# Altium schematic sheet 06_ACCELEROMETER.SchDoc
size A4
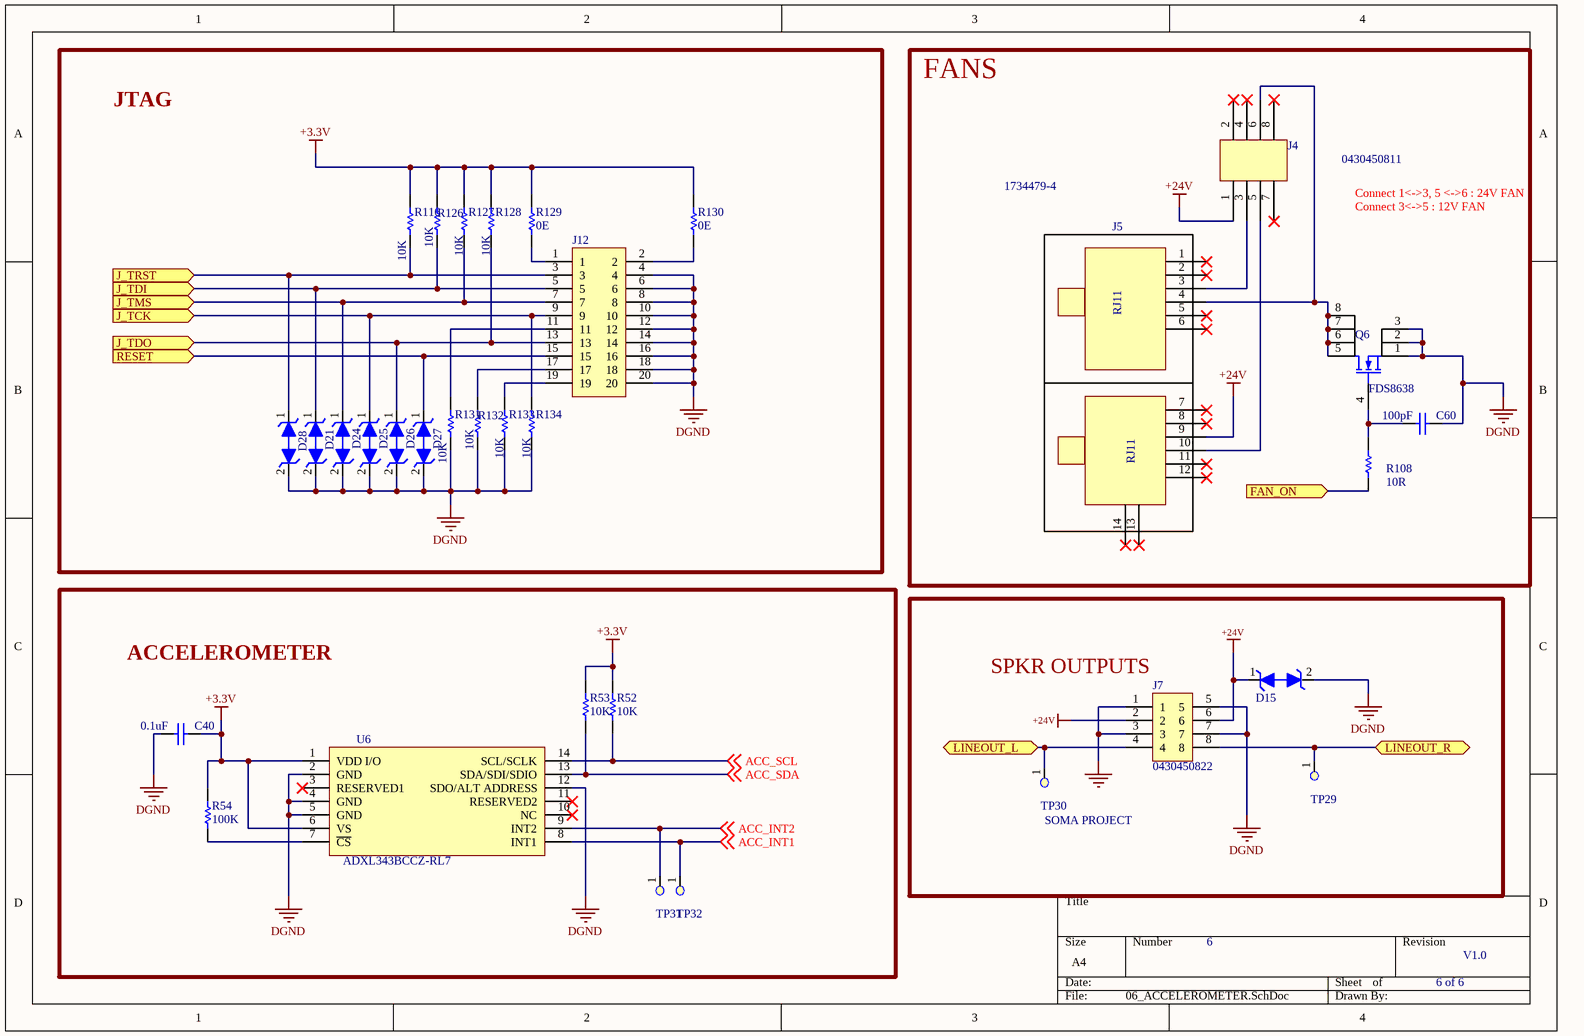
[diagram p0: 06_ACCELEROMETER.SchDoc]

## Parts
C40  0.1uF  [C0402]
C60  value 100pF  [C0402]  (hidden comment: CAP CER 100PF 50V C0G/NP0 0402)
D15  TVS DIODE 24VWM 38.9VC SMC  [SOD8060X260N_BI]  (value not drawn)
D21  TVS DIODE 3.3V 11.5V SOD923  [SOD1006X40N_BI]  (value not drawn)
D24  TVS DIODE 3.3V 11.5V SOD923  [SOD1006X40N_BI]  (value not drawn)
D25  TVS DIODE 3.3V 11.5V SOD923  [SOD1006X40N_BI]  (value not drawn)
D26  TVS DIODE 3.3V 11.5V SOD923  [SOD1006X40N_BI]  (value not drawn)
D27  TVS DIODE 3.3V 11.5V SOD923  [SOD1006X40N_BI]  (value not drawn)
D28  TVS DIODE 3.3V 11.5V SOD923  [SOD1006X40N_BI]  (value not drawn)
J4  value 0430450811  [MOLEX_0430450811]  (hidden comment: CONN HEADER SMD R/A 8POS 3MM)
J5  value 1734479-4  [TE_17344794]  (hidden comment: CONN MOD JACK 6P4C R/A UNSHLD)
J7  value 0430450822  [MOLEX_430450822]  (hidden comment: CONN HEADER R/A 8POS 3MM)
J12  SBH11-NBPC-D10-SM-BK  [SULLINS_SBH11-NBPC-D10-SM-BK]  (value not drawn)
Q6  value FDS8638  [SOIC127P600X175-8N]  (hidden comment: MOSFET N-CH 40V 18A 8SOIC)
R52  10K  [R0402]
R53  10K  [R0402]
R54  100K  [R0402]
R108  value 10R  [R0402]  (hidden comment: RES SMD 10 OHM 5% 1/16W 0402)
R116  10K  [R0402]
R126  10K  [R0402]
R127  10K  [R0402]
R128  10K  [R0402]
R129  0E  [R0603]
R130  0E  [R0603]
R131  10K  [R0402]
R132  10K  [R0402]
R133  10K  [R0402]
R134  10K  [R0402]
TP29  Test Point,1.6mm Diameter,SMD  [TP_63C]  (value not drawn)  (no BOM)
TP30  Test Point,1.6mm Diameter,SMD  [TP_63C]  (value not drawn)  (no BOM)
TP31  Test Point,1.6mm Diameter,SMD  [TP_63C]  (value not drawn)  (no BOM)
TP32  Test Point,1.6mm Diameter,SMD  [TP_63C]  (value not drawn)  (no BOM)
U6  Manufacturer part Number: ADXL343BCCZ-RL7  [LGA14R80P8X6_500X300X100N]  (hidden comment: ACCEL 2-16G I2C/SPI 14LGA)

## Blocks framed on the sheet
JTAG: D21 D24-D28 J12 R116 R126-R134
FANS: C60 J4 J5 Q6 R108
ACCELEROMETER: C40 R52-R54 TP31 TP32 U6
SPKR OUTPUTS: D15 J7 TP29 TP30

## Ports
FAN_ON (in), J_TCK (in), J_TDI (in), J_TDO (in), J_TMS (in), J_TRST (in), LINEOUT_L (bidir), LINEOUT_R (bidir), RESET (in)

## Nets
+3.3V: C40.1 R52.2 R53.2 R54.2 R116.2 R126.2 R127.2 R128.2 R129.2 R130.2 U6.1(VDD_I/O) U6.6(VS)
+24V: D15.1(K) J4.1 J5.9 J7.2 J7.6
DGND: C40.2 C60.1 D15.2(A) D21.2(A) D24.2(A) D25.2(A) D26.2(A) D27.2(A) D28.2(A) J7.5 J7.7 J12.4 J12.6 J12.8 J12.10 J12.12 J12.14 J12.16 J12.18 J12.20 Q6.1 Q6.2 Q6.3 R131.1 R132.1 R133.1 R134.1 U6.2(GND) U6.4(GND) U6.5(GND) U6.12(SDO/ALT_ADDRESS)
GND: J7.1 J7.3
ACC_INT1: TP32.1 U6.8(INT1) ; off-sheet ACC_INT1
ACC_INT2: TP31.1 U6.9(INT2) ; off-sheet ACC_INT2
ACC_SCL: R52.1 U6.14(SCL/SCLK) ; off-sheet ACC_SCL
ACC_SDA: R53.1 U6.13(SDA/SDI/SDIO) ; off-sheet ACC_SDA
FAN_ON: R108.1 ; port FAN_ON
J_TCK: D25.1(K) J12.9 R134.2 ; port J_TCK
J_TDI: D21.1(K) J12.5 R126.1 ; port J_TDI
J_TDO: D26.1(K) J12.13 R128.1 ; port J_TDO
J_TMS: D24.1(K) J12.7 R127.1 ; port J_TMS
J_TRST: D28.1(K) J12.3 R116.1 ; port J_TRST
LINEOUT_L: J7.4 TP30.1 ; port LINEOUT_L
LINEOUT_R: J7.8 TP29.1 ; port LINEOUT_R
RESET: D27.1(K) J12.15 ; port RESET
NetC60_2: C60.2 Q6.4 R108.2
NetJ4_3: J4.3 J5.3
NetJ4_5: J4.5 J5.10
NetJ4_6: J4.6 J5.4 Q6.5 Q6.6 Q6.7 Q6.8
NetJ12_1: J12.1 R129.1
NetJ12_2: J12.2 R130.1
NetJ12_11: J12.11 R131.2
NetJ12_17: J12.17 R132.2
NetJ12_19: J12.19 R133.2
NetR54_1: R54.1 U6.7(~{CS})

Not connected (* = marked no-connect by the designer): J4 2* 4* 7* 8*; J5 1* 2* 5* 6* 7* 8* 11* 12* 13* 14*; U6 3(RESERVED1)* 10(NC)* 11(RESERVED2)*

## Notes on the sheet
- (near TP30) SOMA PROJECT
- 6
- 6 of 6
- V1.0
- Labels drawn without touching a wire or pin: Connect 1<->3, 5 <->6 : 24V FAN, Connect 3<->5 : 12V FAN
- (in symbol CONN MOD JACK 6P4C R/A UNSHLD) RJ11

## Library data of the parts
C40 = CAP CER 0.1UF 50V X7R 0402_1: CAP CER 0.1UF 50V X7R 0402; Manufacturer: AVX Corporation; Manufacturer part Number: 04025C104KAT2A; Tolerance: ±10%; Package: 0402; Value: 0.1uF; Operating Temperature: -55°C ~ 125°C; Distributor: Digikey; Reference link: https://www.digikey.in/product-detail/en/avx-corporation/04025C104KAT2A/478-10043-1-ND/6564266; Distributor part Number: 478-10043-1-ND; Type: CAP; Unit Price: 7.46000; Rating: 50V
C60 = CAP CER 100PF 50V C0G/NP0 0402: 100 pF ±5% 50V Ceramic Capacitor C0G, NP0 0402 (1005 Metric); Manufacturer: KEMET; Manufacturer part Number: C0402C101J5GACTU; Tolerance: ±5%; Operating Temperature: -55°C ~ 125°C; Package: 0402 (1005 Metric); Distributor: Digikey; Distributor part Number: 399-3194-1-ND; Reference link: https://www.digikey.com/en/products/detail/kemet/C0402C101J5GACTU/569895?s=N4IgTCBcDaIMIAYAsCxwIwPQKQKwHEBBOAFQFUQBdAXyA; Unit Price: $0.10000; Type: CAP; Rating: 50V
D15 = TVS DIODE 24VWM 38.9VC SMC: 38.9V Clamp 77.2A Ipp Tvs Diode Surface Mount DO-214AB (SMC); Manufacturer: Bourns Inc.; Manufacturer part Number: SMLJ24CA-Q; Rating: 3000W (3kW); Tolerance: NA; Operating Temperature: -55°C ~ 150°C (TJ); Value: 38.9V Clamp 77.2A; Package: DO-214AB, SMC; Distributor: Digikey; Type: TVS; Reference link: https://www.digikey.com/en/products/detail/bourns-inc/SMLJ24CA-Q/8275811; Distributor part Number: SMLJ24CA-QCT-ND; Unit Price: $1.45000
D21 D24-D28 = Diode,ESD9B3.3ST5G: Manufacturer: ON Semiconductor; Assembly Option: DNP; Tolerance: NA; Manufacturer Part Number: ESD9B3.3ST5G; Operating Temperature: -55°C to +150°C; Value: 3.3V 11.5V; Cost: 0.03416; Distributor: Digikey; Distributor part Number: ESD9B3.3ST5GOSTR-ND; Package: SOD-923; Rating: 3.3V 11.5V; Reference link: https://www.digikey.com/product-detail/en/on-semiconductor/ESD9B3.3ST5G/ESD9B3.3ST5GOSTR-ND/1973669; Type: TVS
J4 = CONN HEADER SMD R/A 8POS 3MM: Connector Header Surface Mount, Right Angle 8 position 0.118" (3.00mm); Manufacturer: Molex; Rating: 600V 8A; Tolerance: NA; Unit Price: $5.40000; Distributor: Digikey; Distributor part Number: WM1834CT-ND; Manufacturer part Number: 0430450811; Package: Cut Tape (CT); Reference link: https://www.digikey.com/en/products/detail/molex/0430450811/4030798; Type: Header, Male Pin
J5 = CONN MOD JACK 6P4C R/A UNSHLD: Jack Modular Connector 6p4c (RJ11, RJ14) 90° Angle (Right) Unshielded Cat3; Manufacturer: TE Connectivity AMP Connectors; Tolerance: NA; Unit Price: $2.69000; Distributor: Digikey; Distributor part Number: A119279-ND; Manufacturer part Number: 1734479-4; Package: Tray; Rating: Cat3; Reference link: https://www.digikey.com/en/products/detail/te-connectivity-amp-connectors/1734479-4/4897898?s=N4IgTCBcDaIIwHYDMAWFCCcBaFIC6AvkA; Type: Jack, Through Hole
J7 = CONN HEADER R/A 8POS 3MM: Connector Header Through Hole, Right Angle 8 position 0.118" (3.00mm); Manufacturer: Molex; Rating: 600V,8A; Tolerance: NA; Package: Tray; Operating Temperature: -40°C ~ 105°C; Unit Price: $3.18000; Distributor: Digikey; Distributor part Number: WM2681-ND; Manufacturer part Number: 0430450822; Reference link: https://www.digikey.com/en/products/detail/molex/0430450822/1635032?s=N4IgTCBcDaIAwBYDMiCscAcYIF0C%2BQA; Type: Header
J12 = SBH11-NBPC-D10-SM-BK: Manufacturer: Sullins; Tolerance: NA; Unit Price: $1.68000; Distributor: Digikey; Distributor part Number: S9188-ND; Manufacturer part Number: SBH11-NBPC-D10-SM-BK; Reference link: https://www.digikey.at/product-detail/en/sullins-connector-solutions/SBH11-NBPC-D10-SM-BK/S9188-ND/1990081; Type: JTAG
Q6 = MOSFET N-CH 40V 18A 8SOIC: N-Channel 40 V 18A (Ta) 2.5W (Ta) Surface Mount 8-SOIC; Manufacturer: ON Semiconductor; Rating: 40 V 18A 2.5W; Tolerance: NA; Type: Transistors - FETs, MOSFETs - Single, N-Channel; Unit Price: $2.12000; Distributor: Digikey; Distributor part Number: FDS8638CT-ND; Manufacturer part Number: FDS8638; Package: 8-SOIC (0.154", 3.90mm Width); Reference link: https://www.digikey.com/en/products/detail/on-semiconductor/FDS8638/2051638?s=N4IgTCBcDaIGIBEDKAOAbAZhSAugXyA
R52 R53 R116 R126-R128 R131-R134 = RES SMD 10K OHM 1% 1/10W 0402: 10 kOhms ±1% 0.1W, 1/10W Chip Resistor 0402 (1005 Metric) Automotive AEC-Q200 Thick Film; Manufacturer: Panasonic Electronic Components; Manufacturer part Number: ERJ-2RKF1002X; Operating Temperature: -55°C ~ 155°C; Reference link: https://www.digikey.in/product-detail/en/panasonic-electronic-components/ERJ-2RKF1002X/P10.0KLCT-ND/194119; Distributor: Digikey; Distributor part Number: P10.0KLCT-ND; Package: 0402; Type: RES; Rating: 1/10W; Cost: 0.00715; Tolerance: ±1%; Value: 10K
R54 = RES SMD 100K OHM 1% 1/10W 0402: 100 kOhms ±1% 0.1W, 1/10W Chip Resistor 0402 (1005 Metric) Automotive AEC-Q200 Thick Film; Manufacturer: Panasonic Electronic Components; Manufacturer part Number: ERJ-2RKF1003X; Operating Temperature: -55°C ~ 155°C; Package: 0402; Distributor: Digikey; Type: RES; Reference link: https://www.digikey.in/product-detail/en/panasonic-electronic-components/ERJ-2RKF1003X/P100KLCT-ND/194127; Distributor part Number: P100KLCT-ND; Tolerance: ±1%; Rating: 1/10W; Value: 100K; Unit Price: 7.46000
R108 = RES SMD 10 OHM 5% 1/16W 0402: 10 Ohms ±5% 0.063W, 1/16W Chip Resistor 0402 (1005 Metric) Automotive AEC-Q200 Thick Film; Manufacturer: Vishay Dale; Manufacturer part Number: CRCW040210R0JNED; Rating: AEC-Q200  0.063W, 1/16W; Tolerance: ±5%; Distributor: Digikey; Package: 0402 (1005 Metric); Operating Temperature: -55°C ~ 155°C; Type: RES; Distributor part Number: 541-10JCT-ND; Reference link: https://www.digikey.com/en/products/detail/vishay-dale/CRCW040210R0JNED/1177520; Unit Price: $0.10000
R129 R130 = RES SMD 0 OHM JUMPER 1/10W 0603: Manufacturer part Number: RC0603JR-070RL; Manufacturer: Yageo; Operating Temperature: -55°C ~ 155°C; Distributor: Digikey; Package: 0603; Type: RES; Distributor part Number: 311-0.0GRCT-ND; Reference link: https://www.digikey.com/product-detail/en/yageo/RC0603JR-070RL/311-0.0GRCT-ND/729622; Rating: 1/10W; Cost: 0.00412; Value: 0E
U6 = ACCEL 2-16G I2C/SPI 14LGA: Accelerometer X, Y, Z Axis ±2g, 4g, 8g, 16g 0.05Hz ~ 1.6kHz 14-LGA (3x5); Manufacturer: Analog Devices Inc.; Tolerance: NA; Value: ADXL343BCCZ-RL7; Rating: 2V ~ 3.6V; Distributor: Digikey; Distributor part Number: ADXL343BCCZ-RL7CT-ND; Reference link: https://www.digikey.com/en/products/detail/analog-devices-inc/ADXL343BCCZ-RL7/3542894; Package: 14-VFLGA; Operating Temperature: -40°C ~ 85°C (TA); Type: Surface Mount; Unit Price: $3.10000
TP29-TP32 = Test Point,1.6mm Diameter,SMD: AEMCI Part Number: *; Vendor: *; Vendor ID: *